# EAGLE schematic arduino_to_bluetooth_hm-10 (EAGLE 9.0.1)
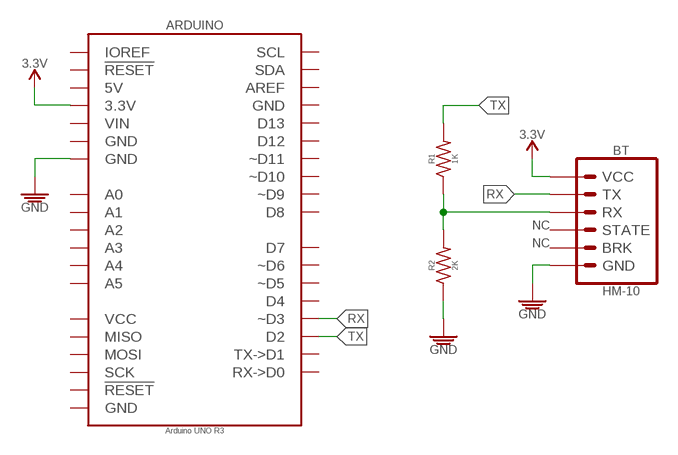
[diagram p0: schematic, sheet 1]

## Parts
ARDUINO  Arduino UNO R3  ARDUINO_UNO_R3  [ARDUINO_UNO_R3]
BT  HM-10  BLUETOOTH_HM-101X06-RA-FEMALE  [1X06-RA-FEMALE_CONNECTOR_BLUETOOTH_HM-10]
R1  1K  1KΩ_PTH-0207/7_1/4W-5%  [RESISTOR-PTH-0207/7]
R2  2K  2KΩ_PTH-0207/7_1/4W-5%  [RESISTOR-PTH-0207/7]

## Nets
3.3V: ARDUINO.3.3V BT.RX(VCC)
GND: ARDUINO.GND@3(GND) BT.TX(GND) R2.1
RX: ARDUINO.D3(~D3) BT.GND(TX) BT.VCC(RX) R1.1 R2.2
TX: ARDUINO.D2 R1.2
Unconnected: ARDUINO.5V ARDUINO.A0 ARDUINO.A1 ARDUINO.A2 ARDUINO.A3 ARDUINO.A4 ARDUINO.A5 ARDUINO.AREF ARDUINO.D0(RX->D0) ARDUINO.D1(TX->D1) ARDUINO.D4 ARDUINO.D5(~D5) ARDUINO.D6(~D6) ARDUINO.D7 ARDUINO.D8 ARDUINO.D9(~D9) ARDUINO.D10(~D10) ARDUINO.D11(~D11) ARDUINO.D12 ARDUINO.D13 ARDUINO.GND@1(GND) ARDUINO.GND@2(GND) ARDUINO.GND@4(GND) ARDUINO.IOREF ARDUINO.MISO ARDUINO.MOSI ARDUINO.RESET@1(!RESET!) ARDUINO.RESET@2(!RESET!) ARDUINO.SCK ARDUINO.SCL ARDUINO.SDA ARDUINO.VCC ARDUINO.VIN BT.BRK BT.STATE

## Library data of the parts
ARDUINO = PiB_boards:ARDUINO_UNO_R3; DATASHEET: https://media.digikey.com/pdf/Data%20Sheets/Arduino%20PDFs/A000066_Web.pdf; DATASHEET_CABLE: http://www.assmann-wsw.com/fileadmin/datasheets/ASS_7066_CA.pdf; DIST: Digikey; DISTLINK: https://www.digikey.com/products/en?keywords=1050-1024-ND; DISTLINK_CABLE: https://www.digikey.com/products/en?keywords=AE1462-ND; DISTPN: 1050-1024-ND; DISTPN_CABLE: AE1462-ND; DIST_CABLE: Digikey; MFR: Arduino; MFR_CABLE: Assmann WSW Components; MPN: A000066; MPN_CABLE: AK672/2-1
BT = PiB_radio_frequency:BLUETOOTH_HM-10; DATASHEET: http://fab.cba.mit.edu/classes/863.15/doc/tutorials/programming/bluetooth/bluetooth40_en.pdf; DATASHEET_CONNECTOR: http://sullinscorp.com/catalogs/101_PAGE114-115_.100_FEMALE_HDR.pdf; DIST: Amazon; DISTLINK: https://www.amazon.com/SunFounder-Bluetooth-Master-Module-Arduino/dp/B00V07U93U; DISTLINK_CONNECTOR: https://www.digikey.com/products/en/connectors-interconnects/rectangular-connectors-headers-receptacles-female-sockets/315?k=S5442-ND; DISTPN: BC24838; DISTPN_CONNECTOR: S5442-ND; DIST_CONNECTOR: Digikey; MFR: JNHuaMao Technology Company; MFR_CONNECTOR: Sullins Connector Solutions; MPN: HM-10; MPN_CONNECTOR: PPTC061LGBN-RC
R1 = PiB_resistors:1KΩ; DATASHEET: http://www.yageo.com/documents/recent/Yageo%20LR_CFR_2013.pdf; DIST: Digikey; DISTLINK: https://www.digikey.com/products/en?keywords=1.0KQBK-ND; DISTPN: 1.0KQBK-ND; MFR: Yageo; MPN: CFR-25JB-52-1K
R2 = PiB_resistors:2KΩ; DATASHEET: http://www.yageo.com/documents/recent/Yageo%20LR_CFR_2013.pdf; DIST: Digikey; DISTLINK: https://www.digikey.com/products/en?keywords=2.0KQBK-ND; DISTPN: 2.0KQBK-ND; MFR: Yageo; MPN: CFR-25JB-52-2K